# EAGLE design esp32_db_v0 (EAGLE 7.6.0)
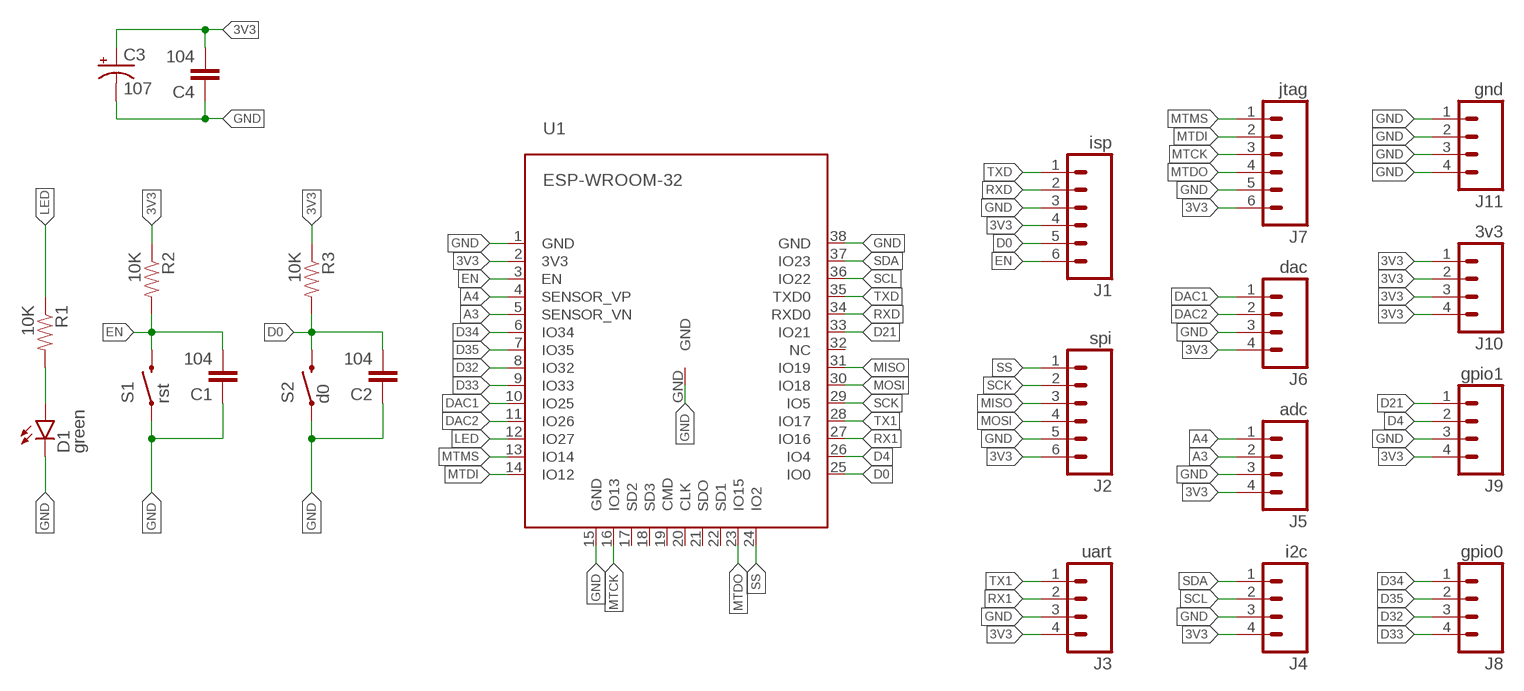
[diagram p0: schematic, sheet 1]

## Parts
C1  104  CAP0603-CAP  [0603-CAP]
C2  104  CAP0603-CAP  [0603-CAP]
C3  107  CAP_POL3528-KIT  [EIA3528-KIT]
C4  104  CAP0603-CAP  [0603-CAP]
D1  green  LED-EASY  [LED-0603-EASY]
J1  isp  M06NO_SILK_FEMALE_PTH  [1X06_NO_SILK]
J2  spi  M06NO_SILK_FEMALE_PTH  [1X06_NO_SILK]
J3  uart  M04NO_SILK_ALL_ROUND  [1X04_NO_SILK_ALL_ROUND]
J4  i2c  M04NO_SILK_ALL_ROUND  [1X04_NO_SILK_ALL_ROUND]
J5  adc  M04NO_SILK_ALL_ROUND  [1X04_NO_SILK_ALL_ROUND]
J6  dac  M04NO_SILK_ALL_ROUND  [1X04_NO_SILK_ALL_ROUND]
J7  jtag  M06NO_SILK_FEMALE_PTH  [1X06_NO_SILK]
J8  gpio0  M04NO_SILK_ALL_ROUND  [1X04_NO_SILK_ALL_ROUND]
J9  gpio1  M04NO_SILK_ALL_ROUND  [1X04_NO_SILK_ALL_ROUND]
J10  3v3  M04NO_SILK_ALL_ROUND  [1X04_NO_SILK_ALL_ROUND]
J11  gnd  M04NO_SILK_ALL_ROUND  [1X04_NO_SILK_ALL_ROUND]
R1  10K  RESISTOR0603-RES  [0603-RES]
R2  10K  RESISTOR0603-RES  [0603-RES]
R3  10K  RESISTOR0603-RES  [0603-RES]
S1  rst  SWITCH-MOMENTARY-2PTH  [TACTILE-PTH]
S2  d0  SWITCH-MOMENTARY-2PTH  [TACTILE-PTH]
U1  ESP-WROOM-32  [ESP-WROOM-32]

## Nets
3V3: C3.A(+) C4.2 J1.4 J2.6 J3.4 J4.4 J5.4 J6.4 J7.6 J9.4 J10.1 J10.2 J10.3 J10.4 R2.1 R3.1 U1.2(3V3)
A3: J5.2 U1.5(SENSOR_VN)
A4: J5.1 U1.4(SENSOR_VP)
D0: C2.2 J1.5 R3.2 S2.3 U1.25(IO0)
D4: J9.2 U1.26(IO4)
D21: J9.1 U1.33(IO21)
D32: J8.3 U1.8(IO32)
D33: J8.4 U1.9(IO33)
D34: J8.1 U1.6(IO34)
D35: J8.2 U1.7(IO35)
DAC1: J6.1 U1.10(IO25)
DAC2: J6.2 U1.11(IO26)
EN: C1.2 J1.6 R2.2 S1.3 U1.3(EN)
GND: C1.1 C2.1 C3.C(-) C4.1 D1.-(C) J1.3 J2.5 J3.3 J4.3 J5.3 J6.3 J7.5 J9.3 J11.1 J11.2 J11.3 J11.4 S1.1 S2.1 U1.1(GND) U1.15(GND) U1.38(GND) U1.GND
LED: R1.1 U1.12(IO27)
MISO: J2.3 U1.31(IO19)
MOSI: J2.4 U1.30(IO18)
MTCK: J7.3 U1.16(IO13)
MTDI: J7.2 U1.14(IO12)
MTDO: J7.4 U1.23(IO15)
MTMS: J7.1 U1.13(IO14)
N$5: D1.+(A) R1.2
RX1: J3.2 U1.27(IO16)
RXD: J1.2 U1.34(RXD0)
SCK: J2.2 U1.29(IO5)
SCL: J4.2 U1.36(IO22)
SDA: J4.1 U1.37(IO23)
SS: J2.1 U1.24(IO2)
TX1: J3.1 U1.28(IO17)
TXD: J1.1 U1.35(TXD0)
Unconnected: U1.17(SD2) U1.18(SD3) U1.19(CMD) U1.20(CLK) U1.21(SDO) U1.22(SD1) U1.32(NC)

## Library data of the parts
C1 C2 C4 = z_jlc_smt:CAP: Capacitor Standard 0603 ceramic capacitor, and 0.1" leaded capacitor.
C3 = z_jlc_smt:CAP_POL: Capacitor Polarized These are standard SMD and PTH capacitors. Normally 10uF, 47uF, and 100uF in electrolytic and tantalum varieties. Always verify the external diameter of the through hole cap, it varies with capacity, voltage, and manufacturer. The EIA devices should be standard.
D1 = z_jlc_smt:LED: LEDs Standard schematic elements and footprints for 5mm, 3mm, 1206, and 0603 sized LEDs. 5mm - Spark Fun Electronics SKU : COM-00529 (and others)
J1 J2 J7 = SparkFun-Connectors:M06: Header 6 Standard 6-pin 0.1" header. Use with straight break away headers (SKU : PRT-00116), right angle break away headers (PRT-00553), swiss pins (PRT-00743), machine pins (PRT-00117), and female headers (PRT-00115). Molex polarized connector foot print use with SKU : PRT-08094 with associated crimp pins and housings. NOTES ON THE VARIANTS LOCK and LOCK_LONGPADS... This footprint was designed to help hold the alignment of a through-hole component (i.e. 6-pin header) while soldering it into place. You may notice that each hole has been shifted either up or down by 0.005 of an inch from it's more standard position (which is a perfectly straight line). This slight alteration caused the pins (the squares in the middle) to touch the edges of the holes. Because they are alternating, it causes a "brace" to hold the component in place. 0.005 has proven to be the perfect amount of "off-center" position when using our standard breakaway headers. Although looks a little odd when you look at the bare footprint, once you have a header in there, the alteration is very hard to notice. Also,if you push a header all the way into place, it is covered up entirely on the bottom side. This idea of altering the position of holes to aid alignment will be further integrated into the Sparkfun Library for other footprints. It can help hold any component with 3 or more connection pins.; PROD_ID: CONN-08437
J3-J6 J8-J11 = SparkFun-Connectors:M04: Header 4 Standard 4-pin 0.1" header. Use with straight break away headers (SKU : PRT-00116), right angle break away headers (PRT-00553), swiss pins (PRT-00743), machine pins (PRT-00117), and female headers (PRT-00115). Molex polarized connector foot print use with SKU : PRT-08231 with associated crimp pins and housings. 1MM SMD Version SKU: PRT-10208; PROD_ID: CONN-09696
R1-R3 = z_jlc_smt:RESISTOR: Resistor Basic schematic elements and footprints for 0603, 1206, and PTH resistors.
S1 S2 = xmgu2008:SWITCH-MOMENTARY-2: Various NO switches- pushbuttons, reed, etc; PROD_ID: SWCH-08441
U1 = esp32:ESP-WROOM-32

## Board
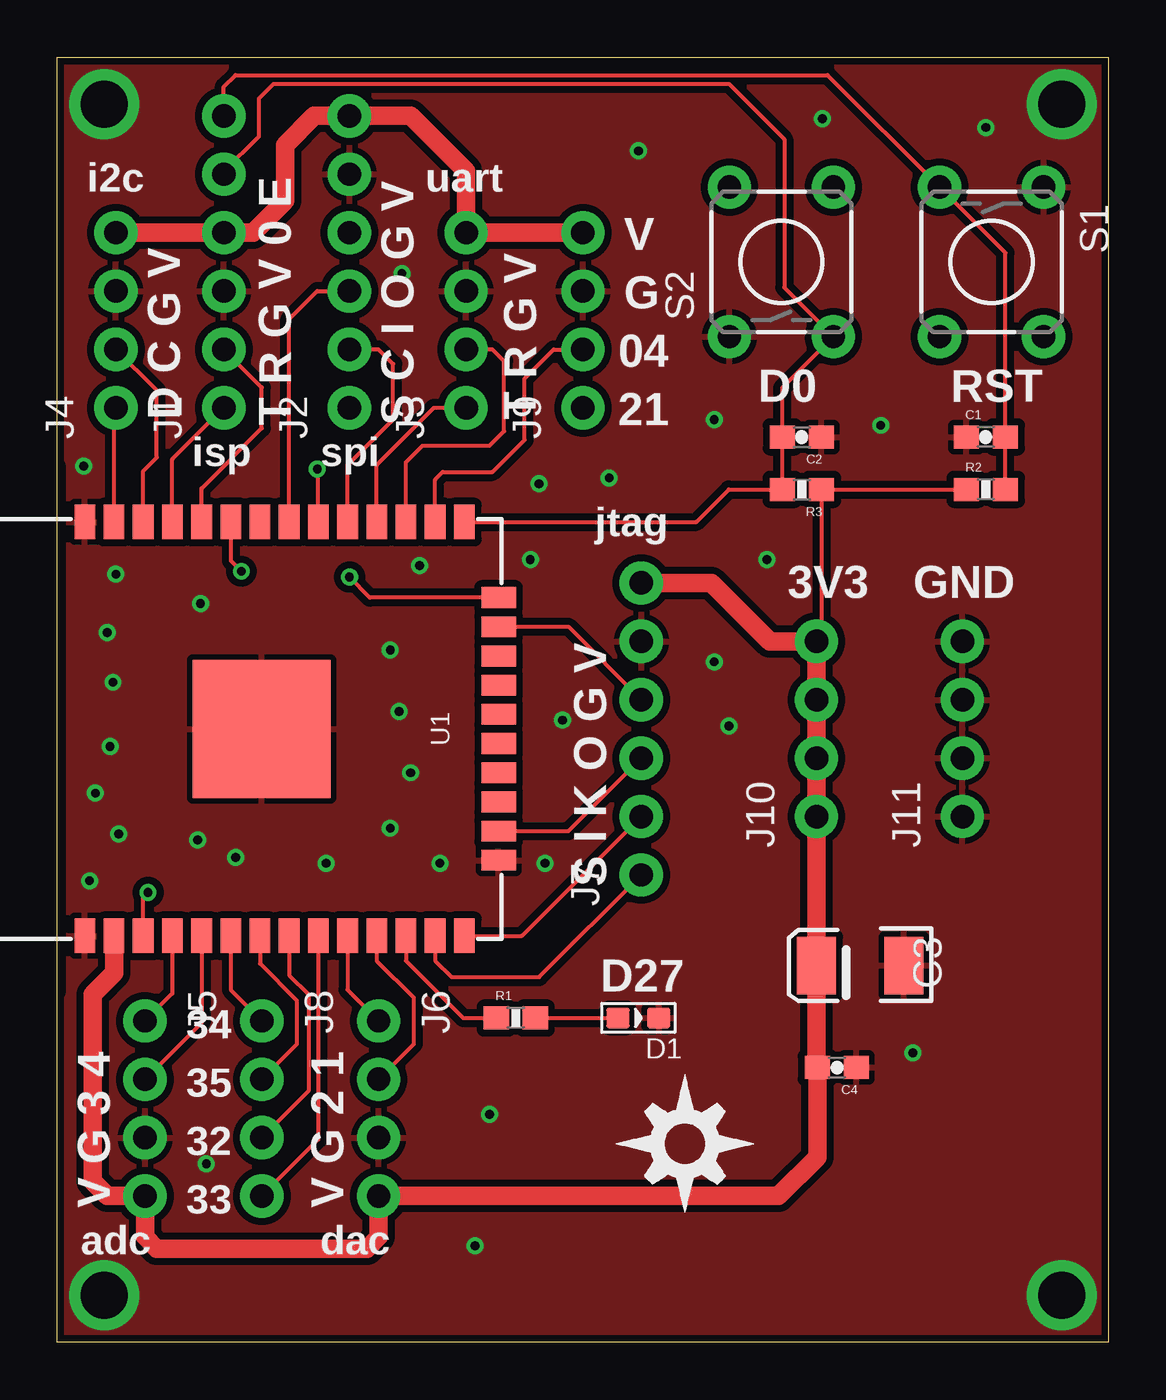
[diagram p1: board, top side]
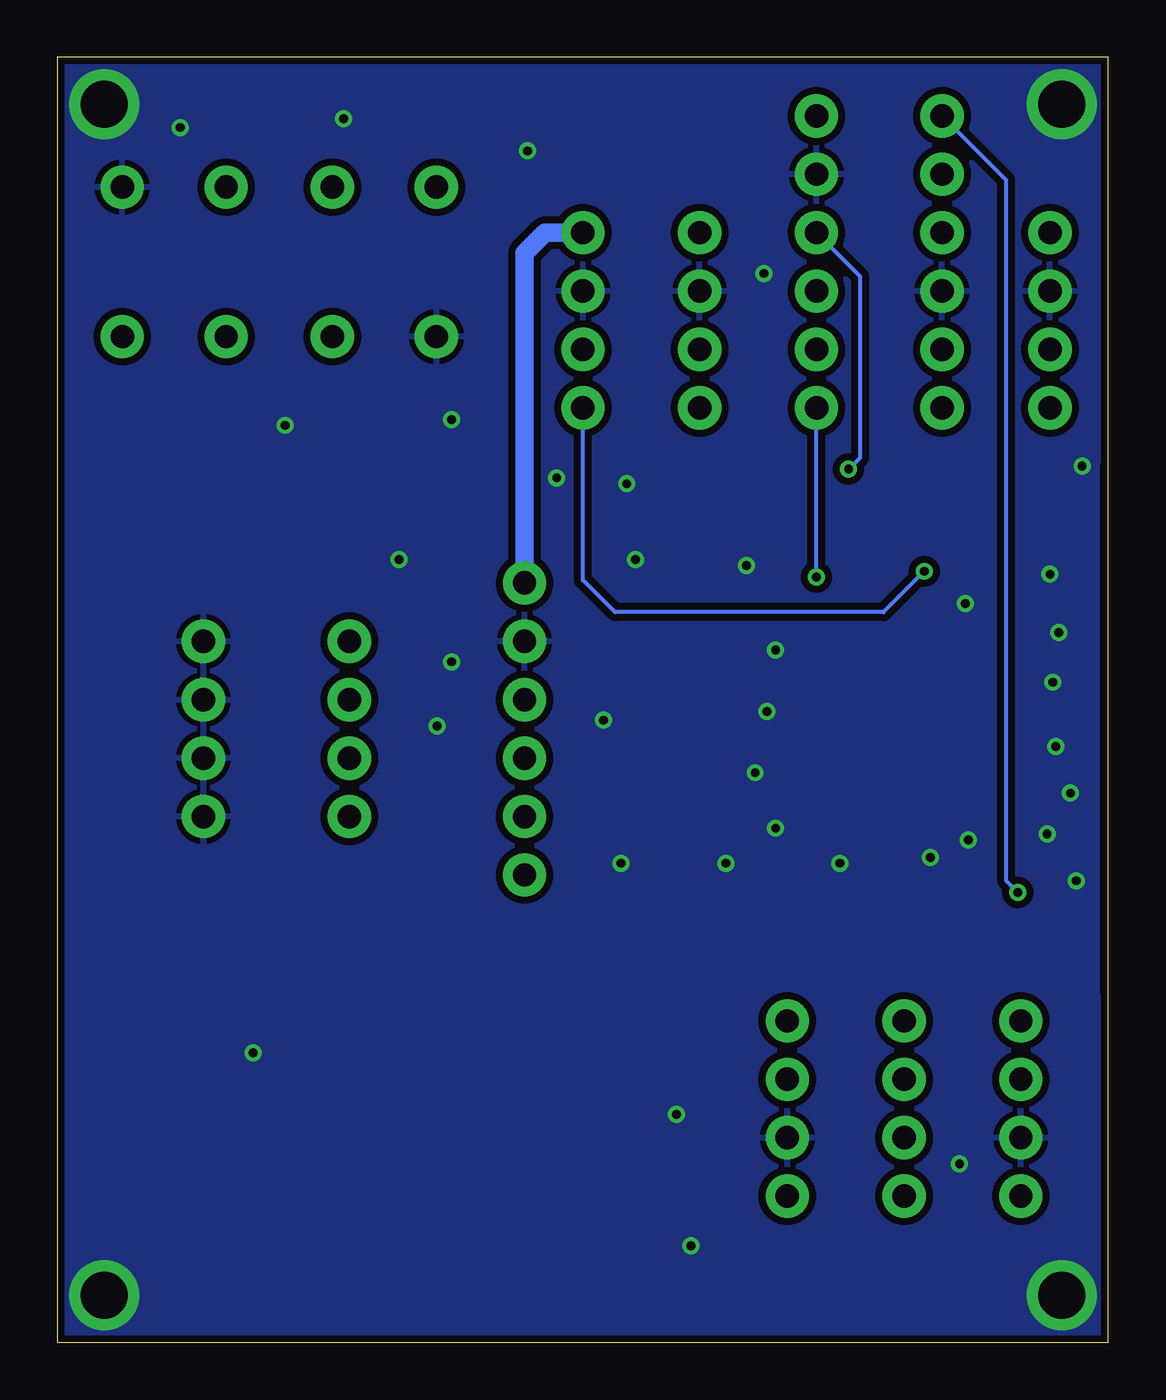
[diagram p2: board, bottom side, seen from below]

Size 45.72 x 55.88 mm. Coordinates in mm from the lower left corner, seen from the top.
Outline: 0,0 0,55.88 45.72,55.88 45.72,0 0,0
Copper layers (1*16): Top 0.035mm / dielectric 1.5mm / Bottom 0.035mm
Design rules "SparkFun-2-layer-TIGHT": minimum track width 7mil, minimum drill 15mil, track to track 7mil, track to pad 7mil, pad to pad 7mil, via to via 7mil, smd to smd 7mil, copper to edge 7mil, drill to drill 7mil, minimum pad ring 7mil, minimum via ring 7mil, stop-mask expansion 4mil, vias tented up to drill 20mil, thermal gap 10mil

### Footprints (pad centres in the part's own frame; a part is rotated, then mirrored left to right if it is on the bottom)
0603-CAP = smd 1.1 x 1: 1 -0.85,0; 2 0.85,0
EIA3528-KIT = smd 1.7 x 2.5: A 1.9,0; C -1.9,0
LED-0603-EASY = smd 1.016 x 0.889: + 0.889,0; - -0.889,0
1X06_NO_SILK = drill 1.016 pad 1.88: 1 0,0; 2 2.54,0; 3 5.08,0; 4 7.62,0; 5 10.16,0; 6 12.7,0
1X04_NO_SILK_ALL_ROUND = drill 1.016 pad 1.88: 1 0,0; 2 2.54,0; 3 5.08,0; 4 7.62,0
0603-RES = smd 1.1 x 1: 1 -0.85,0; 2 0.85,0
TACTILE-PTH = drill 1.016 pad 1.88: 1 -3.251,2.261; 2 3.251,2.261; 3 -3.251,-2.261; 4 3.251,-2.261
ESP-WROOM-32 = smd 0.9 x 1.5: 1 7.7,9; 2 6.43,9; 3 5.16,9; 4 3.89,9; 5 2.62,9; 6 1.35,9; 7 0.08,9; 8 -1.19,9; 9 -2.46,9; 10 -3.73,9; 11 -5,9; 12 -6.27,9; 13 -7.54,9; 14 -8.81,9; 25 -8.81,-9; 26 -7.54,-9; 27 -6.27,-9; 28 -5,-9; 29 -3.73,-9; 30 -2.46,-9; 31 -1.19,-9; 32 0.08,-9; 33 1.35,-9; 34 2.62,-9; 35 3.89,-9; 36 5.16,-9; 37 6.43,-9; 38 7.7,-9 | smd 1.5 x 0.9: 15 -10.3,5.715; 16 -10.3,4.445; 17 -10.3,3.175; 18 -10.3,1.905; 19 -10.3,0.635; 20 -10.3,-0.635; 21 -10.3,-1.905; 22 -10.3,-3.175; 23 -10.3,-4.445; 24 -10.3,-5.715 | smd 6 x 6: GND 0,0

### Placement (x,y rotation side)
C1  40.39,39.37 0 top
C2  32.38,39.37 180 top
C3  34.92,16.38 180 top
C4  33.91,11.94 180 top
D1  25.27,14.1 180 top
J1  7.24,40.64 90 top
J2  12.7,40.64 90 top
J3  17.78,40.64 90 top
J4  2.54,40.64 90 top
J5  3.81,13.97 270 top
J6  13.97,13.97 270 top
J7  25.4,20.32 90 top
J8  8.89,13.97 270 top
J9  22.86,40.64 90 top
J10  33.02,22.86 90 top
J11  39.37,22.86 90 top
R1  19.94,14.1 0 top
R2  40.39,37.08 0 top
R3  32.38,37.08 180 top
S1  40.64,46.99 270 top
S2  31.5,46.99 90 top
U1  8.89,26.67 180 top
U$1  [DIYNOVA_LOGO]  24.26,5.59 0 top

### Tracks (layer width: path | path; a pad name or v marks a point on that pad's centre or on a via)
3V3
  Top 0.178: R2.1 R3.1 33.23,30.7 J10.4
  Top 0.813: U1.2 2.46,16.05 1.52,15.11 1.52,6.99 2.16,6.35 J5.4 3.81,4.57 4.32,4.06 13.46,4.06 13.97,4.57 J6.4 31.37,6.35 33.06,8.04 C4.2 33.02,11.97 C3.A J10.1 J10.2 J10.3 J10.4 30.99,30.48 28.45,33.02 J7.6 | J4.4 J1.4 8.51,48.26 9.91,49.66 9.91,52.07 11.18,53.34 J2.6 15.37,53.34 17.78,50.93 J3.4 J9.4
  Bottom 0.813: J7.6 25.4,47.37 24.51,48.26 J9.4
A3
  Top 0.178: U1.5 6.27,13.89 J5.2
A4
  Top 0.178: U1.4 5,15.16 J5.1
D0
  Top 0.178: U1.25 27.8,35.67 29.21,37.08 R3.2 C2.2 31.54,41.52 S2.3 31.62,45.87 31.62,52.32 29.21,54.74 9.4,54.74 8.76,54.1 8.76,52.45 7.24,50.93 J1.5
D4
  Top 0.178: U1.26 16.43,37.51 16.76,37.85 18.92,37.85 20.32,39.24 20.32,41.91 21.59,43.18 J9.2
D21  (via drill 0.38)
  Top 0.178: U1.33 7.54,33.99 v8,33.53
  Bottom 0.178: v8,33.53 9.78,31.75 21.46,31.75 22.86,33.15 J9.1
D32
  Top 0.178: U1.8 10.08,15.96 10.92,15.11 10.92,10.92 J8.3
D33
  Top 0.178: U1.9 11.35,8.81 J8.4
D34
  Top 0.178: U1.6 7.54,15.32 J8.1
D35
  Top 0.178: U1.7 8.81,16.46 10.41,14.86 10.41,12.95 J8.2
DAC1
  Top 0.178: U1.10 12.62,15.32 J6.1
DAC2
  Top 0.178: U1.11 13.89,16.59 15.49,14.99 15.49,12.95 J6.2
EN  (via drill 0.38)
  Top 0.178: R2.2 C1.2 41.24,47.38 S1.3 33.5,55.12 7.75,55.12 7.24,54.61 J1.6 | U1.3 3.73,19.35 v3.94,19.56
  Bottom 0.178: v3.94,19.56 4.45,20.07 4.45,50.55 J1.6
GND  (via drill 0.38, 2.03)
  other vias: 28.57,40.13 35.81,39.88 30.86,34.04 29.21,26.8 21.97,27.05 14.86,27.43 15.37,24.77 14.48,22.35 11.68,20.83 7.75,21.08 6.1,21.84 2.67,22.1 2.29,25.91 2.16,30.86 2.54,33.4 6.22,32.13 14.48,30.1 15.75,33.78 20.57,34.04 20.95,37.34 24,37.59 25.27,51.82 14.99,46.48 28.57,29.59 18.8,9.91 18.16,4.19 37.21,12.57 6.48,7.75 40.39,52.83 33.27,53.21 2.03,2.03 43.69,2.03 43.69,53.85 2.03,53.85 1.4,20.07 1.65,23.88 2.41,28.7 1.14,38.1 16.64,20.83 21.21,20.83
  pour Top (isolate 0.305): 0,0 0,55.88 45.72,55.88 45.72,0
  pour Bottom (isolate 0.305): 0,0 0,55.88 45.72,55.88 45.72,0
LED
  Top 0.178: U1.12 15.16,16.59 17.65,14.1 R1.1
MISO
  Top 0.178: U1.31 10.08,44.5 11.3,45.72 J2.3
MOSI  (via drill 0.38)
  Top 0.178: U1.30 11.35,37.93 v11.3,37.97
  Bottom 0.178: v11.3,37.97 10.79,38.48 10.79,46.35 J2.4
MTCK
  Top 0.178: U1.16 22.23,22.23 J7.3
MTDI
  Top 0.178: U1.14 20.21,17.67 J7.2
MTDO
  Top 0.178: U1.23 22.23,31.11 J7.4
MTMS
  Top 0.178: U1.13 16.43,16.59 17.14,15.88 20.95,15.88 J7.1
N$5
  Top 0.178: R1.2 D1.+
RX1
  Top 0.178: U1.27 15.16,38.27 15.88,38.99 18.8,38.99 19.43,39.62 19.43,42.67 18.92,43.18 J3.2
RXD
  Top 0.178: U1.34 6.27,37.13 8.89,39.75 8.89,41.53 J1.2
SCK
  Top 0.178: U1.29 12.62,38.15 14.61,40.13 14.61,42.55 13.97,43.18 J2.2
SCL
  Top 0.178: U1.36 3.73,37.89 4.32,38.48 4.32,41.4 J4.2
SDA
  Top 0.178: U1.37 2.46,40.56 J4.1
SS  (via drill 0.38)
  Top 0.178: U1.24 13.59,32.38 v12.7,33.27
  Bottom 0.178: v12.7,33.27 J2.1
TX1
  Top 0.178: U1.28 13.89,38.15 16.38,40.64 J3.1
TXD
  Top 0.178: U1.35 5,38.4 J1.1

### Text on the board
tPlace: i2c | uart | V | G | 04 | D0 | RST | D C G V | T R G V 0 E | S C I O G V | T R G V | 21 | isp | spi | jtag | 3V3 | GND | S I K O G V | D27 | 34 | 35 | 32 | V G 3 4 | 33 | V G 2 1 | adc | dac